# EAGLE schematic Receiver (EAGLE 6.4)
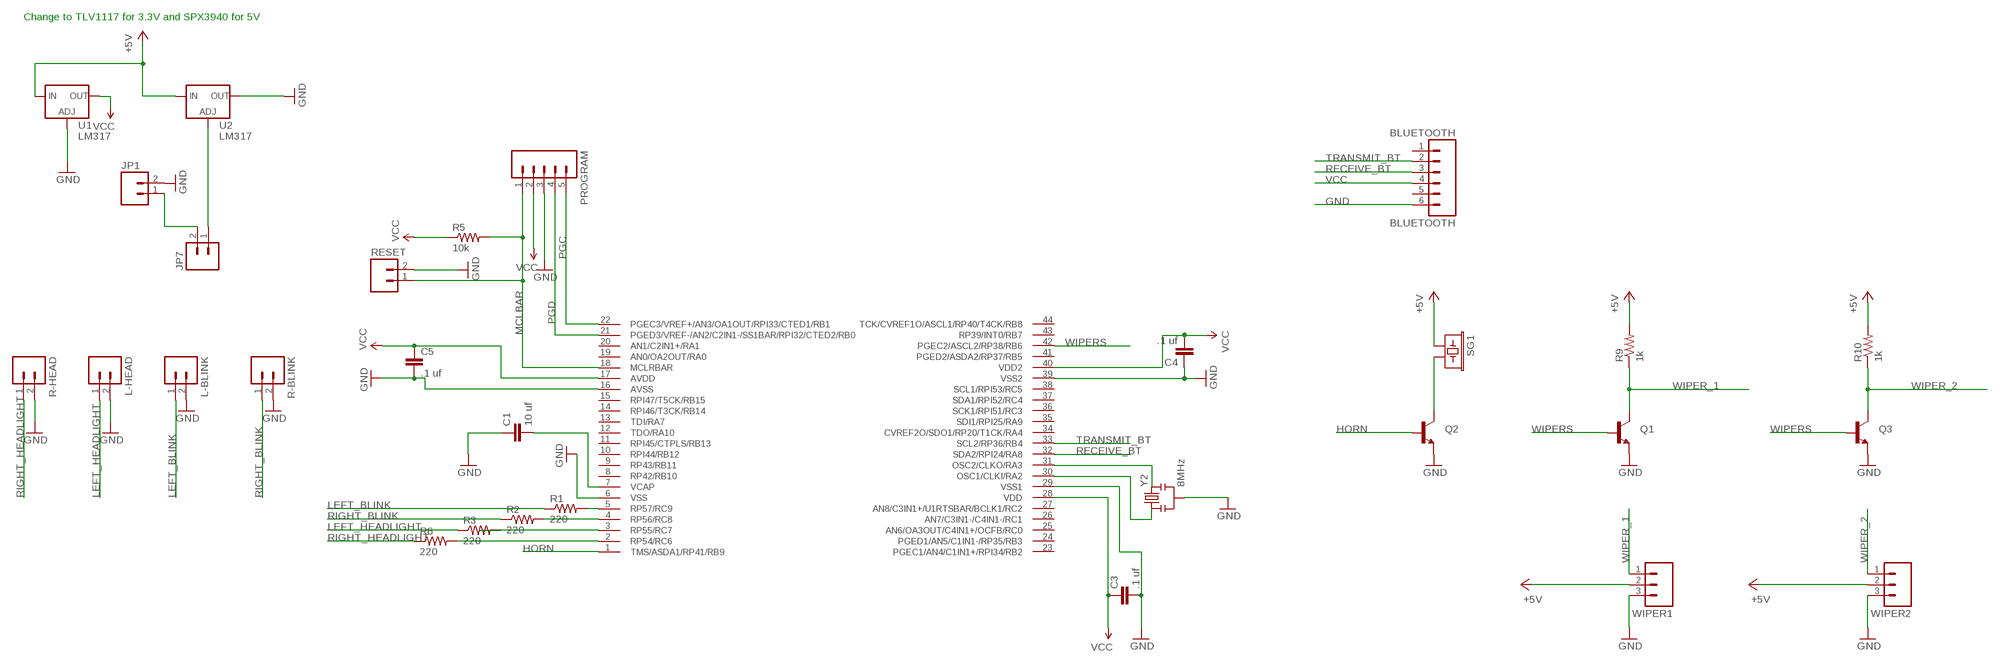
[diagram p0: schematic, sheet 1]

## Parts
BLUETOOTH  BLUETOOTH  M06POLAR  [MOLEX-1X6]
C1  10 uf  CAP0603-CAP  [0603-CAP]
C3  .1 uf  CAP0603-CAP  [0603-CAP]
C4  .1 uf  CAP0603-CAP  [0603-CAP]
C5  .1 uf  CAP0603-CAP  [0603-CAP]
JP1  M02LOCK  [1X02_LOCK]
JP7  M02LOCK  [1X02_LOCK]
L-BLINK  M02LOCK  [1X02_LOCK]
L-HEAD  M02LOCK  [1X02_LOCK]
PROGRAM  M05LOCK  [1X05_LOCK]
Q1  TRANSISTOR_NPNSOT23-3  [SOT23-3]
Q2  TRANSISTOR_NPNSOT23-3  [SOT23-3]
Q3  TRANSISTOR_NPNSOT23-3  [SOT23-3]
R1  220  RESISTOR0603-RES  [0603-RES]
R2  220  RESISTOR0603-RES  [0603-RES]
R3  220  RESISTOR0603-RES  [0603-RES]
R5  10k  RESISTOR0603-RES  [0603-RES]
R6  220  RESISTOR0603-RES  [0603-RES]
R9  1k  RESISTOR0603-RES  [0603-RES]
R10  1k  RESISTOR0603-RES  [0603-RES]
R-BLINK  M02LOCK  [1X02_LOCK]
R-HEAD  M02LOCK  [1X02_LOCK]
RESET  M02PTH  [1X02]
SG1  BUZZERNS  [BUZZER-12MM-NS]
U1  LM317  V_REG_317SMD  [SOT223]
U2  LM317  V_REG_317SMD  [SOT223]
U$1  TQFP44PIC24EP256GP204  [TQFP44]
WIPER1  M03LOCK  [1X03_LOCK]
WIPER2  M03LOCK  [1X03_LOCK]
Y2  8MHz  RESONATORSMD  [RESONATOR-SMD]

## Nets
+5V: R9.2 R10.2 SG1.+ U1.3(IN) U2.3(IN) WIPER1.2 WIPER2.2
GND: BLUETOOTH.6 C1.1 C3.2 C4.1 C5.2 JP1.2 L-BLINK.2 L-HEAD.2 PROGRAM.3 Q1.2(E) Q2.2(E) Q3.2(E) R-BLINK.2 R-HEAD.2 RESET.2 U1.1(ADJ) U2.2(OUT) U$1.6(VSS) U$1.16(AVSS) U$1.29(VSS1) U$1.39(VSS2) WIPER1.3 WIPER2.3 Y2.2
HORN: Q2.1(B) U$1.1(TMS/ASDA1/RP41/RB9)
LEFT_BLINK: L-BLINK.1 R1.1
LEFT_HEADLIGHT: L-HEAD.1 R3.1
MCLBAR: PROGRAM.1 R5.2 RESET.1 U$1.18(MCLRBAR)
N$1: R1.2 U$1.5(RP57/RC9)
N$2: R2.2 U$1.4(RP56/RC8)
N$3: R3.2 U$1.3(RP55/RC7)
N$4: R6.2 U$1.2(RP54/RC6)
N$5: JP7.1 U2.1(ADJ)
N$6: JP1.1 JP7.2
N$10: Q2.3(C) SG1.-
N$11: U$1.31(OSC2/CLKO/RA3) Y2.3
N$12: U$1.30(OSC1/CLKI/RA2) Y2.1
N$13: C1.2 U$1.7(VCAP)
PGC: PROGRAM.5 U$1.22(PGEC3/VREF+/AN3/OA1OUT/RPI33/CTED1/RB1)
PGD: PROGRAM.4 U$1.21(PGED3/VREF-/AN2/C2IN1-/SS1BAR/RPI32/CTED2/RB0)
RECEIVE_BT: BLUETOOTH.3 U$1.32(SDA2/RPI24/RA8)
RIGHT_BLINK: R2.1 R-BLINK.1
RIGHT_HEADLIGHT: R6.1 R-HEAD.1
TRANSMIT_BT: BLUETOOTH.2 U$1.33(SCL2/RP36/RB4)
VCC: BLUETOOTH.4 C3.1 C4.2 C5.1 PROGRAM.2 R5.1 U1.2(OUT) U$1.17(AVDD) U$1.28(VDD) U$1.40(VDD2)
WIPER_1: Q1.3(C) R9.1 WIPER1.1
WIPER_2: Q3.3(C) R10.1 WIPER2.1
WIPERS: Q1.1(B) Q3.1(B) U$1.42(PGEC2/ASCL2/RP38/RB6)
Unconnected: BLUETOOTH.1 BLUETOOTH.5 U$1.8(RP42/RB10) U$1.9(RP43/RB11) U$1.10(RPI44/RB12) U$1.11(RPI45/CTPLS/RB13) U$1.12(TDO/RA10) U$1.13(TDI/RA7) U$1.14(RPI46/T3CK/RB14) U$1.15(RPI47/T5CK/RB15) U$1.19(AN0/OA2OUT/RA0) U$1.20(AN1/C2IN1+/RA1) U$1.23(PGEC1/AN4/C1IN1+/RPI34/RB2) U$1.24(PGED1/AN5/C1IN1-/RP35/RB3) U$1.25(AN6/OA3OUT/C4IN1+/OCFB/RC0) U$1.26(AN7/C3IN1-/C4IN1-/RC1) U$1.27(AN8/C3IN1+/U1RTSBAR/BCLK1/RC2) U$1.34(CVREF2O/SDO1/RP20/T1CK/RA4) U$1.35(SDI1/RPI25/RA9) U$1.36(SCK1/RPI51/RC3) U$1.37(SDA1/RPI52/RC4) U$1.38(SCL1/RPI53/RC5) U$1.41(PGED2/ASDA2/RP37/RB5) U$1.43(RP39/INT0/RB7) U$1.44(TCK/CVREF1O/ASCL1/RP40/T4CK/RB8)

## Notes on the sheet
- Change to TLV1117 for 3.3V and SPX3940 for 5V

## Library data of the parts
BLUETOOTH = SparkFun:M06: Header 6 Standard 6-pin 0.1" header. Use with straight break away headers (SKU : PRT-00116), right angle break away headers (PRT-00553), swiss pins (PRT-00743), machine pins (PRT-00117), and female headers (PRT-00115). Molex polarized connector foot print use with SKU : PRT-08094 with associated crimp pins and housings. NOTES ON THE VARIANTS LOCK and LOCK_LONGPADS... This footprint was designed to help hold the alignment of a through-hole component (i.e. 6-pin header) while soldering it into place. You may notice that each hole has been shifted either up or down by 0.005 of an inch from it's more standard position (which is a perfectly straight line). This slight alteration caused the pins (the squares in the middle) to touch the edges of the holes. Because they are alternating, it causes a "brace" to hold the component in place. 0.005 has proven to be the perfect amount of "off-center" position when using our standard breakaway headers. Although looks a little odd when you look at the bare footprint, once you have a header in there, the alteration is very hard to notice. Also, if you push a header all the way into place, it is covered up entirely on the bottom side. This idea of altering the position of holes to aid alignment will be further integrated into the Sparkfun Library for other footprints. It can help hold any component with 3 or more connection pins.
C1 C3-C5 = SparkFun:CAP: Capacitor Standard 0603 ceramic capacitor, and 0.1" leaded capacitor.
JP1 JP7 L-BLINK L-HEAD R-BLINK R-HEAD RESET = SparkFun:M02: Header 2 Standard 2-pin 0.1" header. Use with straight break away headers (SKU : PRT-00116), right angle break away headers (PRT-00553), swiss pins (PRT-00743), machine pins (PRT-00117), and female headers (PRT-00115). Molex polarized connector foot print use with SKU : PRT-08233 with associated crimp pins and housings.
PROGRAM = SparkFun:M05: Header 5 Standard 5-pin 0.1" header. Use with straight break away headers (SKU : PRT-00116), right angle break away headers (PRT-00553), swiss pins (PRT-00743), machine pins (PRT-00117), and female headers (PRT-00115). Molex polarized connector foot print use with SKU : PRT-08230 with associated crimp pins and housings.
Q1-Q3 = SparkFun:TRANSISTOR_NPN: Transistor NPN BJT configuration in SOT23 package. MMBT2222 is the common NPN we use. Double check BCE configuration again layout.
R1-R3 R5 R6 R9 R10 = SparkFun:RESISTOR: Resistor Basic schematic elements and footprints for 0603, 1206, and PTH resistors.
SG1 = SparkFun:BUZZER: Buzzer 12mm Spark Fun Electronics SKU : Comp-Buzzer
U1 U2 = SparkFun:V_REG_317: Voltage Regulator Standard LM317 adjustable voltage regulator. AOI (Adjust Output Input). Google 'LM317 Calculator' for easy to use app to get the two resistor values needed. 240/720 for 5V output. 240/390 for 3.3V output. Spark Fun Electronics SKU : COM-00527
U$1 = SparkFun:TQFP44
WIPER1 WIPER2 = SparkFun:M03: Header 3 Standard 3-pin 0.1" header. Use with straight break away headers (SKU : PRT-00116), right angle break away headers (PRT-00553), swiss pins (PRT-00743), machine pins (PRT-00117), and female headers (PRT-00115). Molex polarized connector foot print use with SKU : PRT-08232 with associated crimp pins and housings.
Y2 = SparkFun:RESONATOR: Resonator Small SMD resonator. This is the itty bitty 10/20MHz resonators with built in caps. CSTCE10M0G55 and CSTCE20M0V53. Footprint has been reviewed closely but hasn't been tested yet.